# Altium schematic sheet topcontroller.SchDoc
size A; DocumentNumber: 2; SheetNumber: 1
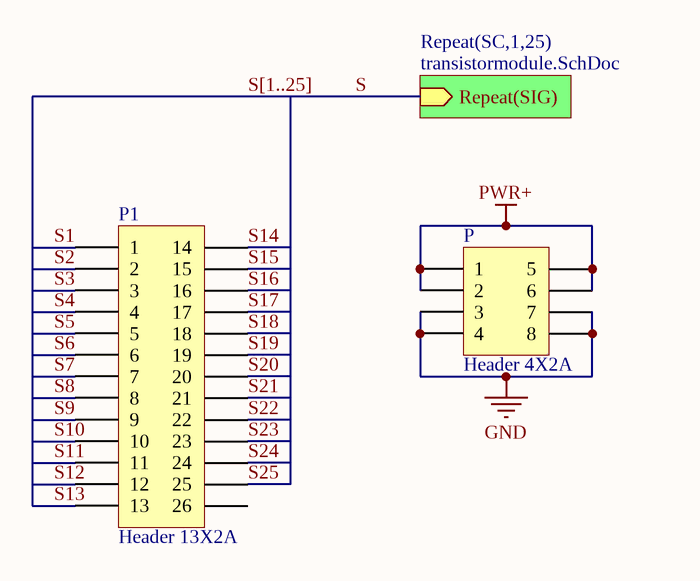
[diagram p0: topcontroller.SchDoc]

## Parts
P  Header 4X2A  [HDR2X4_CEN]
P1  Header 13X2A  [HDR2X13_CEN]

## Sub-sheets
Repeat(SC,1,25) = transistormodule.SchDoc: Repeat(SIG) (in)

## Nets
GND: P.3 P.4 P.7 P.8
PWR+: P.1 P.2 P.5 P.6
S: sheet Repeat(SC,1,25)/Repeat(SIG)
S1: P1.1
S2: P1.2
S3: P1.3
S4: P1.4
S5: P1.5
S6: P1.6
S7: P1.7
S8: P1.8
S9: P1.9
S10: P1.10
S11: P1.11
S12: P1.12
S13: P1.13
S14: P1.14
S15: P1.15
S16: P1.16
S17: P1.17
S18: P1.18
S19: P1.19
S20: P1.20
S21: P1.21
S22: P1.22
S23: P1.23
S24: P1.24
S25: P1.25

Not connected (* = marked no-connect by the designer): P1 26

## Buses and harness runs
bus S[1..25]

## Library data of the parts
P = Header 4X2A: Header, 4-Pin, Dual row; LatestRevisionDate: 17-Jul-2002; LatestRevisionNote: Re-released for DXP Platform.; Publisher: Altium Limited
P1 = Header 13X2A: Header, 13-Pin, Dual row; LatestRevisionDate: 17-Jul-2002; LatestRevisionNote: Re-released for DXP Platform.; Publisher: Altium Limited